# Altium schematic sheet 3V3_REG.SchDoc
size A4; SheetNumber: 3; SheetTotal: 12
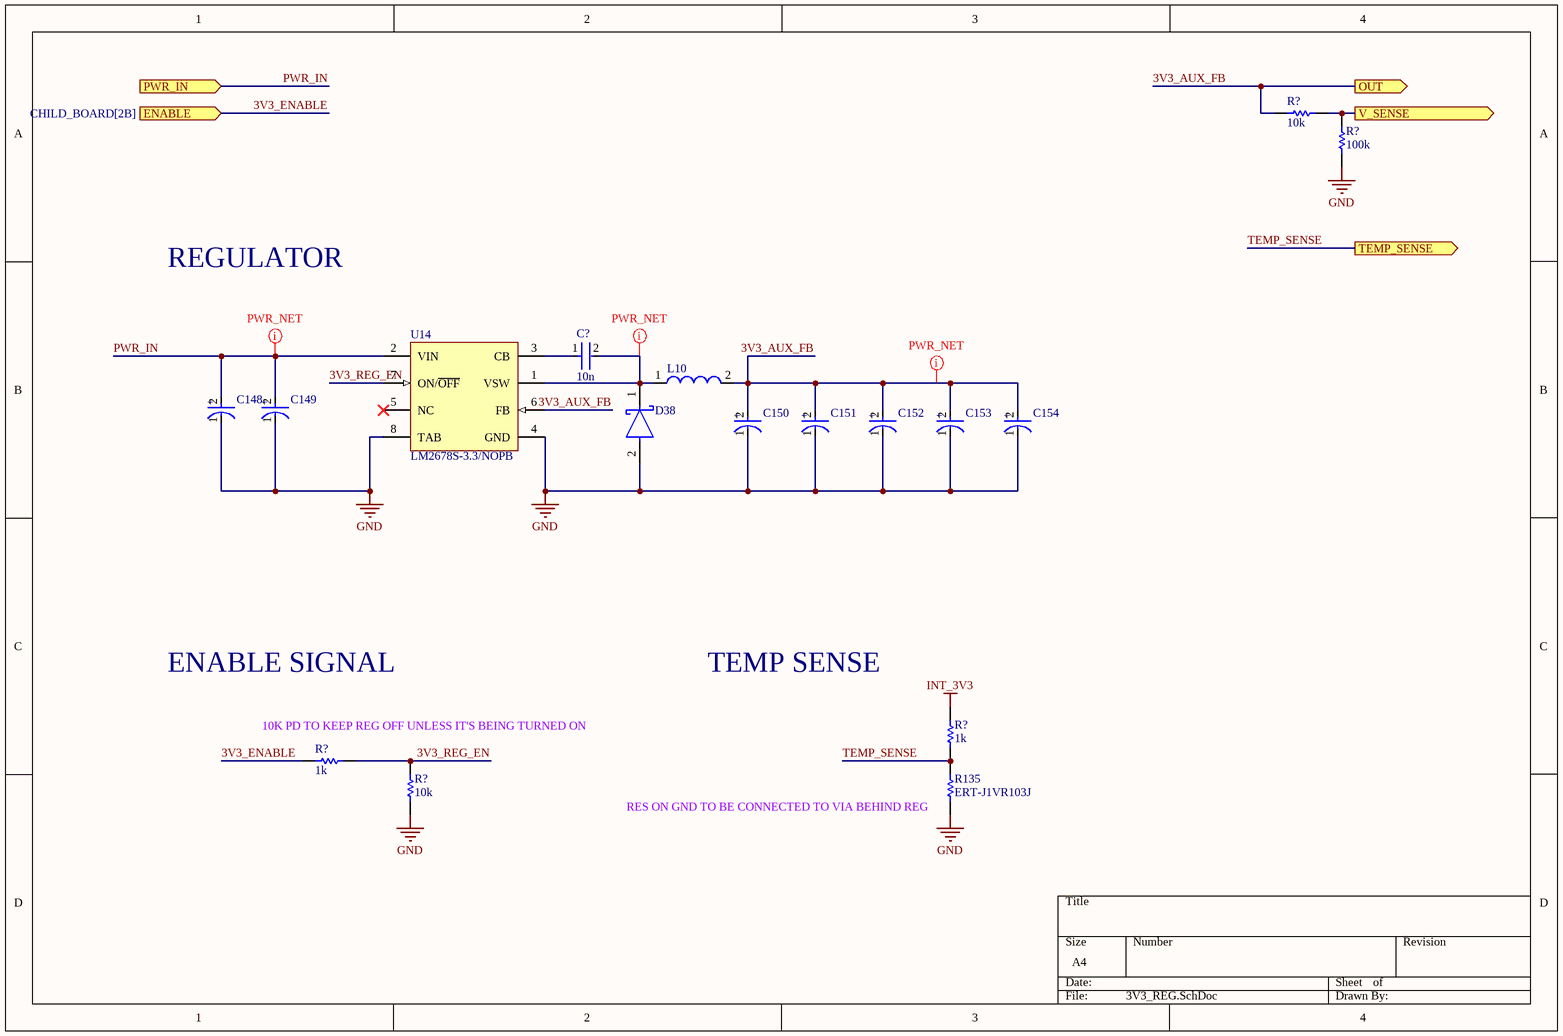
[diagram p0: 3V3_REG.SchDoc]

## Parts
(Parts that share a designator on the sheet are numbered #1, #2 ... from top to bottom, then left to right.)
C148  EEHZA1V680XP  [FP-EEH-D8-MFG]  (value not drawn)
C149  EEHZA1V680XP  [FP-EEH-D8-MFG]  (value not drawn)
C150  16SVPC120M  [FP-OS-CON-SMT-E7-MFG]  (value not drawn)
C151  16SVPC120M  [FP-OS-CON-SMT-E7-MFG]  (value not drawn)
C152  16SVPC120M  [FP-OS-CON-SMT-E7-MFG]  (value not drawn)
C153  16SVPC120M  [FP-OS-CON-SMT-E7-MFG]  (value not drawn)
C154  16SVPC120M  [FP-OS-CON-SMT-E7-MFG]  (value not drawn)
C?  10n  [FP-0402-L_1_0_0_05-W_0_5-IPC_A]
D38  B540C-13-F  [FP-SMC-MFG]  (value not drawn)
L10  74477110  [WE-PD-L]  (value not drawn)
R135  ERT-J1VR103J  [RESC1608X90X30ML15T20]
R?#1  10k  [R0603B]
R?#2  100k  [R0603B]
R?#3  1k  [R0603B]
R?#4  1k  [R0603B]
R?#5  10k  [R0603B]
U14  LM2678S-3.3/NOPB  [KTW0007B_N]

## Ports
ENABLE (in, see CHILD_BOARD[2B]), OUT (out, see CHILD_BOARD[3B]), PWR_IN (in, see CHILD_BOARD[2B]), TEMP_SENSE (out, see CHILD_BOARD[3B]), V_SENSE (out, see CHILD_BOARD[3B])

## Nets
GND: C148.1(C) C149.1(C) C150.1(C) C151.1(C) C152.1(C) C153.1(C) C154.1(C) D38.2(A) R135.1 R?#2.2 R?#5.2 U14.4(GND) U14.8(TAB)
INT_3V3: R?#3.1
3V3_AUX_FB: C150.2(A) C151.2(A) C152.2(A) C153.2(A) C154.2(A) L10.2 R?#1.1 U14.6(FB) ; port OUT
3V3_ENABLE: R?#4.2 ; port ENABLE
3V3_REG_EN: R?#4.1 R?#5.1 U14.7(ON/~{OFF})
PWR_IN: C148.2(A) C149.2(A) U14.2(VIN) ; port PWR_IN
TEMP_SENSE: R135.2 R?#3.2 ; port TEMP_SENSE
V_SENSE: R?#1.2 R?#2.1 ; port V_SENSE
NetC?_1: C?.1 U14.3(CB)
NetC?_2: C?.2 D38.1(C) L10.1 U14.1(VSW)

Not connected (* = marked no-connect by the designer): U14 5(NC)*

## Layout directives
net class PWR: 3V3_AUX_FB, NetC?_2, PWR_IN

## Notes on the sheet
- REGULATOR
- ENABLE SIGNAL
- TEMP SENSE
- (near R?#4) 10K PD TO KEEP REG OFF UNLESS IT'S BEING TURNED ON
- RES ON GND TO BE CONNECTED TO VIA BEHIND REG
- (in symbol CMP-05428-000021-2) +
- (in symbol CMP-05428-001211-1) +

## Library data of the parts
C148 C149 = CMP-05428-001211-1: Conductive Polymer Hybrid Aluminum Electrolytic Capacitors 68uF ±20% 35V RADIAL SMT 6.3x7.7mm; Leakage Current: 23.8uA; Ripple Current (AC): 2A; Polarity: Polar; Life (Hours): 5000Hour; ESR (Equivalent Series Resistance): 35mR; Lead Diameter: 0.65mm; Termination: SMD/SMT; Case/Package: Radial; Package Quantity: 900; Radiation Hardening: No; Max Operating Temperature: 105°C; Capacitance: 68uF; Voltage Rating: 35V; Number of Pins: 8; Mount: Surface Mount; Technology: HYBRID; Diameter: 6.3mm; Min Operating Temperature: -55°C; Length: 7.7mm; Ratings: AEC-Q200; Height - Seated (Max): 0.315inch; Ripple Current: 2A; Lead Free: Lead Free; Voltage: 35V; Lead Pitch: 1.8mm; Voltage Rating (DC): 35V; REACH SVHC: No SVHC; Material: Polymer; Height: 7.7mm; Tolerance: 20%; Construction: Cylindrical; Packaging: Tape and Reel; Series: ZA
C150-C154 = CMP-05428-000021-2: Conductive Polymer Aluminum Solid Capacitors (OS-CON) 120uF ±20% 16V RADIAL SMT 8x6.9mm; Leakage Current: 500uA; Ripple Current: 2.9A; ESR (Equivalent Series Resistance): 27mR; Polarity: Polar; Dissipation Factor: 12%; Life (Hours): 2000Hour; Lead Free: Lead Free; Voltage Rating (DC): 16V; Min Operating Temperature: -55°C; Height - Seated (Max): 0.276inch; Case/Package: Radial; REACH SVHC: No SVHC; Diameter: 8mm; Mount: Surface Mount; Package Quantity: 1000; Construction: Cylindrical; Max Operating Temperature: 105°C; Capacitance: 120uF; Voltage: 16V; Length: 6.9mm; Tolerance: 20%; RoHS Compliant: Yes; Series: OS-CON, SVPC; Packaging: Tape and Reel; Voltage Rating: 16V; Termination: SMD/SMT; Number of Pins: 7; Ripple Current (AC): 2.9A; Height: 6.9mm
C? = CMP-001-00058-1: LARGE PADS, 0402 CAP, CHANGE COMMENT TO MATCH REAL P/N; Capacitor Type: Ceramic; Min Operating Temperature: -55°C; Mounting Technology: Surface Mount; Pins: 2; Case/Package: 0402; RoHS Compliant: Yes; Max Operating Temperature: 85°C
D38 = CMP-2000-05097-3: DIODE SCHOTTKY 40V 5A SMC; Manufacturer: Diodes Inc.; Automotive Grade: NA; Peak Reverse Current: 0.5mA; Value: 300pF; Max Junction Temp: +150°C; Max Surge Forward Current: 100A; Standoff Height: 0.1mm; Digikey Description: DIODE SCHOTTKY 40V 5A SMC; Temperature Range Low: -55°C; Manufacturer Part Number: B540C-13-F; Octopart: https://octopart.com/b540c-13-f-diodes+inc.-325873; Lead Free: Yes; Reverse Voltage: 40V; RoHS: TRUE; Category: Diode; Mouser Description: Diode: Schottky rectifying; SMD; 40V; 5A; SMC; Package: reel, tape; ComponentLink2Description: Datasheet; Temperature Range High: +150°C; Automotive: No; Footprint Url: https://www.diodes.com/assets/Package-Files/SMC.pdf; Device Class L3: Schottky Diodes; Height: 2.5mm; Forward Current: 5A; Temperature: -55°C to +150°C; Package: SMC; ComponentLink2URL: https://www.diodes.com/assets/Datasheets/ds13012.pdf; Device Class L2: Diodes; Max Repetitive Reverse Voltage: 40V; Device Class L1: Discrete Semiconductors; Capacitance: 300pF
L10 = CMP-0227-00708-1: SMD-Shielded Power Inductor WE-PD, L = 10.0 µH; Inductance: 10.0 ÂµH; ComponentLink2Description: Datasheet; DatasheetVersion: ver 7, Sep-2006; PackageVersion: 2006; ComponentLink1URL: http://www.we-online.com; ComponentLink1Description: Manufacturer Link; ComponentLink2URL: http://www.we-online.de/katalog/media/pdf/74477110.pdf; PackageDescription: SMD Inductor, 2-Leads, Body 12.0 x 12.0 mm; PackageReference: WE-PD-L
R135 = CMP-2000-00869-1: Manufacturer: Panasonic; Part Number: ERT-J1VR103J
R?#1-R?#5 = CMP-009-00002-14: Resistor
  R?#1 R?#5: Value: 10k
  R?#2: Value: 100k
  R?#3 R?#4: Value: 1k
U14 = CMP-0069-00195-3: SIMPLE SWITCHER® High Efficiency 5A Step-Down Voltage Regulator, 7-pin TO-263, Pb-Free; Manufacturer: Texas Instruments; PackageTopMarking: NSUZXYTTE#*LM2678*S-3.3; PowerWise: N; PackageReference: KTW0007B; Code_JEDEC: MO-169-AC; CompType: Switcher; RoHS: Y; PackageDescription: TO-263, Molded, .400 x .390 x .180in Body, 7 Lead, .050in Pitch, Surface Mount; ComponentLink1Description: Datasheet URL; PinCount: 7; ComponentLink1URL: http://www.ti.com/general/docs/lit/getliterature.tsp?genericPartNumber=LM2678&fileType=pdf